# Altium schematic sheet Konwerter_USB_RS232_4porty.SchDoc: Konwerter 4x RS232 - USB
size B; Author: Szymon Feliński, Mateusz Goździk; DrawnBy: Szymon Feliński, Mateusz Goździk; SheetNumber: 1; SheetTotal: 1; SPICEModelCacheZGQTQYPO: <root> / <DocumentId>ZGQTQYPO</DocumentId> / <CacheFrame Number="0"> / <Model Name="cap" Kind="MDL"> / <Text>*Default semiconductor capacitor / .MODEL CAP C()</Text> / </Model> / </CacheFrame> / </root>
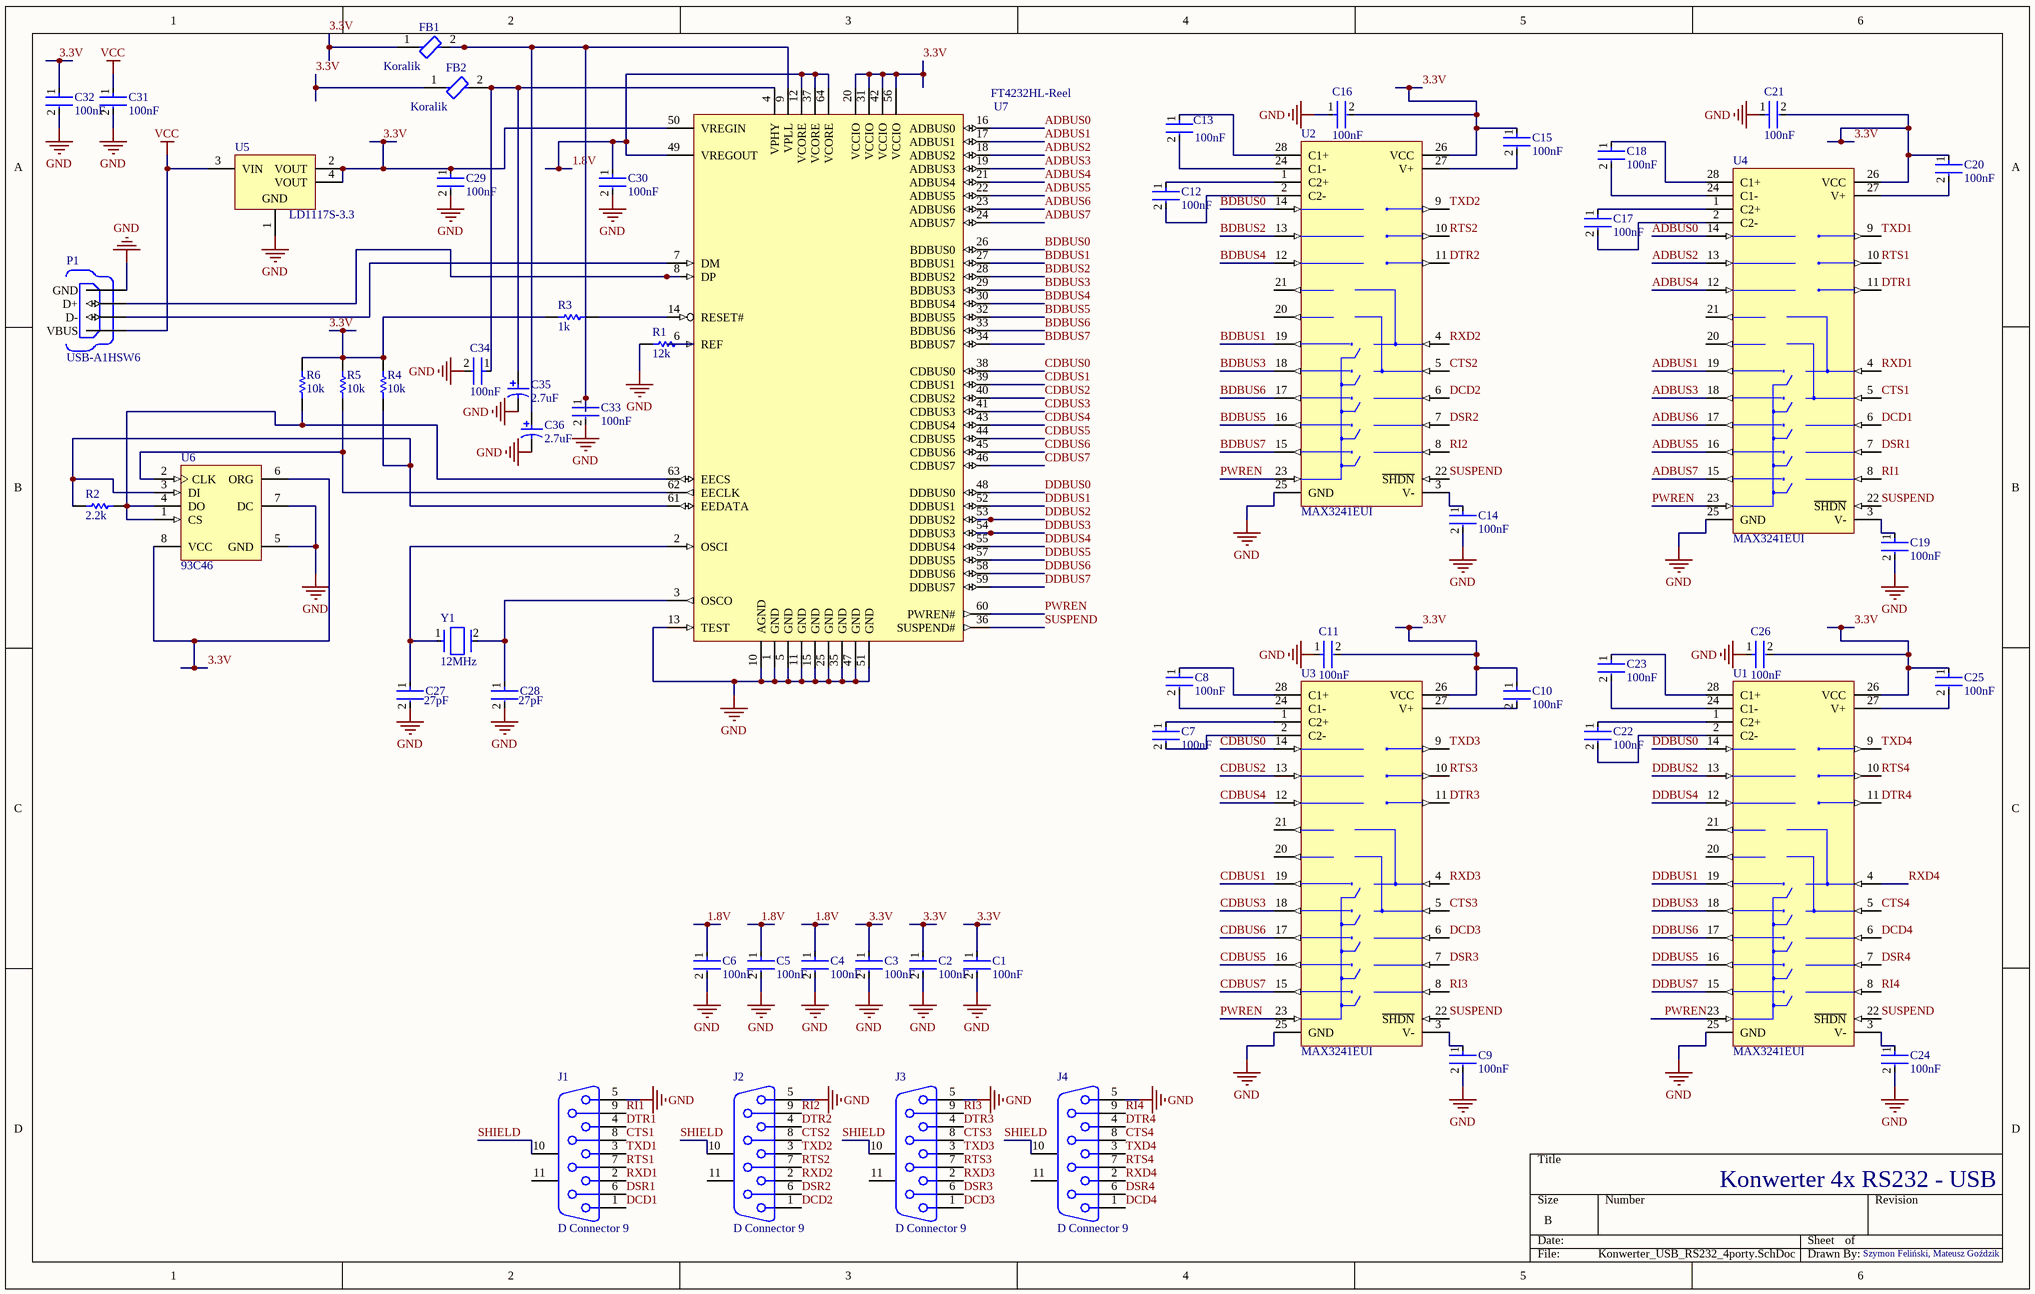
[diagram p0: Konwerter_USB_RS232_4porty.SchDoc]

## Parts
C1  100nF  [FP-C0603C-CF-MFG]
C2  100nF  [FP-C0603C-CF-MFG]
C3  100nF  [FP-C0603C-CF-MFG]
C4  100nF  [FP-C0603C-CF-MFG]
C5  100nF  [FP-C0603C-CF-MFG]
C6  100nF  [FP-C0603C-CF-MFG]
C7  100nF  [FP-C0603C-CF-MFG]
C8  100nF  [FP-C0603C-CF-MFG]
C9  100nF  [FP-C0603C-CF-MFG]
C10  100nF  [FP-C0603C-CF-MFG]
C11  100nF  [FP-C0603C-CF-MFG]
C12  100nF  [FP-C0603C-CF-MFG]
C13  100nF  [FP-C0603C-CF-MFG]
C14  100nF  [FP-C0603C-CF-MFG]
C15  100nF  [FP-C0603C-CF-MFG]
C16  100nF  [FP-C0603C-CF-MFG]
C17  100nF  [FP-C0603C-CF-MFG]
C18  100nF  [FP-C0603C-CF-MFG]
C19  100nF  [FP-C0603C-CF-MFG]
C20  100nF  [FP-C0603C-CF-MFG]
C21  100nF  [FP-C0603C-CF-MFG]
C22  100nF  [FP-C0603C-CF-MFG]
C23  100nF  [FP-C0603C-CF-MFG]
C24  100nF  [FP-C0603C-CF-MFG]
C25  100nF  [FP-C0603C-CF-MFG]
C26  100nF  [FP-C0603C-CF-MFG]
C27  27pF  [FP-C0603C-CF-MFG]
C28  27pF  [FP-C0603C-CF-MFG]
C29  100nF  [FP-C0603C-CF-MFG]
C30  100nF  [FP-C0603C-CF-MFG]
C31  100nF  [FP-C0603C-CF-MFG]
C32  100nF  [FP-C0603C-CF-MFG]
C33  100nF  [FP-C0603C-CF-MFG]
C34  100nF  [FP-C0603C-CF-MFG]
C35  2.7uF  [NIC-UCL1V101MNL1GS_L]
C36  2.7uF  [NIC-UCL1V101MNL1GS_L]
FB1  Koralik  [FP-BLM15-0_05-IPC_A]
FB2  Koralik  [FP-BLM15-0_05-IPC_A]
J1  D Connector 9  [DSUB1.385-2H9]
J2  D Connector 9  [DSUB1.385-2H9]
J3  D Connector 9  [DSUB1.385-2H9]
J4  D Connector 9  [DSUB1.385-2H9]
P1  USB-A1HSW6  [OST_USB-A1HSW6]
R1  12k  [RESC2013X50X30LL20T20]
R2  2.2k  [RESC2013X50X30LL20T20]
R3  1k  [RESC2013X50X30LL20T20]
R4  10k  [RESC2013X50X30LL20T20]
R5  10k  [RESC2013X50X30LL20T20]
R6  10k  [RESC2013X50X30LL20T20]
U1  MAX3241EUI  [TSSOP28_N]
U2  MAX3241EUI  [TSSOP28_N]
U3  MAX3241EUI  [TSSOP28_N]
U4  MAX3241EUI  [TSSOP28_N]
U5  LD1117S-3.3  [SOT-223_L]
U6  93C46  [ATML-8S1_B_L]
U7  FT4232HL-Reel  [LQFP-64_N]
Y1  12MHz  [FP-7A-MFG]

## Nets
GND: C1.2 C2.2 C3.2 C4.2 C5.2 C6.2 C9.2 C11.1 C14.2 C16.1 C19.2 C21.1 C24.2 C26.1 C27.2 C28.2 C29.2 C30.2 C31.2 C32.2 C33.2 C34.2 C35.2 C36.2 J1.5 J2.5 J3.5 J4.5 P1.4(GND) R1.1 U1.25(GND) U2.25(GND) U3.25(GND) U4.25(GND) U5.1(GND) U6.5(GND) U6.7(DC) U7.1(GND) U7.5(GND) U7.10(AGND) U7.11(GND) U7.13(TEST) U7.15(GND) U7.25(GND) U7.35(GND) U7.47(GND) U7.51(GND)
VCC: C31.1 P1.1(VBUS) U5.3(VIN)
1.8V: C4.1 C5.1 C6.1 C30.1 U7.12(VCORE) U7.37(VCORE) U7.49(VREGOUT) U7.64(VCORE)
3.3V: C1.1 C2.1 C3.1 C10.1 C11.2 C15.1 C16.2 C20.1 C21.2 C25.1 C26.2 C29.1 C32.1 FB1.1 FB2.1 R3.1 R4.2 R5.2 R6.2 U1.26(VCC) U2.26(VCC) U3.26(VCC) U4.26(VCC) U5.2(VOUT) U5.4(VOUT) U6.6(ORG) U6.8(VCC) U7.20(VCCIO) U7.31(VCCIO) U7.42(VCCIO) U7.50(VREGIN) U7.56(VCCIO)
ADBUS0: U4.14(T1IN) U7.16(ADBUS0)
ADBUS1: U4.19(R1OUT) U7.17(ADBUS1)
ADBUS2: U4.13(T2IN) U7.18(ADBUS2)
ADBUS3: U4.18(R2OUT) U7.19(ADBUS3)
ADBUS4: U4.12(T3IN) U7.21(ADBUS4)
ADBUS5: U4.16(R4OUT) U7.22(ADBUS5)
ADBUS6: U4.17(R3OUT) U7.23(ADBUS6)
ADBUS7: U4.15(R5OUT) U7.24(ADBUS7)
BDBUS0: U2.14(T1IN) U7.26(BDBUS0)
BDBUS1: U2.19(R1OUT) U7.27(BDBUS1)
BDBUS2: U2.13(T2IN) U7.28(BDBUS2)
BDBUS3: U2.18(R2OUT) U7.29(BDBUS3)
BDBUS4: U2.12(T3IN) U7.30(BDBUS4)
BDBUS5: U2.16(R4OUT) U7.32(BDBUS5)
BDBUS6: U2.17(R3OUT) U7.33(BDBUS6)
BDBUS7: U2.15(R5OUT) U7.34(BDBUS7)
CDBUS0: U3.14(T1IN) U7.38(CDBUS0)
CDBUS1: U3.19(R1OUT) U7.39(CDBUS1)
CDBUS2: U3.13(T2IN) U7.40(CDBUS2)
CDBUS3: U3.18(R2OUT) U7.41(CDBUS3)
CDBUS4: U3.12(T3IN) U7.43(CDBUS4)
CDBUS5: U3.16(R4OUT) U7.44(CDBUS5)
CDBUS6: U3.17(R3OUT) U7.45(CDBUS6)
CDBUS7: U3.15(R5OUT) U7.46(CDBUS7)
CTS1: J1.8 U4.5(R2IN)
CTS2: J2.8 U2.5(R2IN)
CTS3: J3.8 U3.5(R2IN)
CTS4: J4.8 U1.5(R2IN)
DCD1: J1.1 U4.6(R3IN)
DCD2: J2.1 U2.6(R3IN)
DCD3: J3.1 U3.6(R3IN)
DCD4: J4.1 U1.6(R3IN)
DDBUS0: U1.14(T1IN) U7.48(DDBUS0)
DDBUS1: U1.19(R1OUT) U7.52(DDBUS1)
DDBUS2: U1.13(T2IN) U7.53(DDBUS2)
DDBUS3: U1.18(R2OUT) U7.54(DDBUS3)
DDBUS4: U1.12(T3IN) U7.55(DDBUS4)
DDBUS5: U1.16(R4OUT) U7.57(DDBUS5)
DDBUS6: U1.17(R3OUT) U7.58(DDBUS6)
DDBUS7: U1.15(R5OUT) U7.59(DDBUS7)
DSR1: J1.6 U4.7(R4IN)
DSR2: J2.6 U2.7(R4IN)
DSR3: J3.6 U3.7(R4IN)
DSR4: J4.6 U1.7(R4IN)
DTR1: J1.4 U4.11(T3OUT)
DTR2: J2.4 U2.11(T3OUT)
DTR3: J3.4 U3.11(T3OUT)
DTR4: J4.4 U1.11(T3OUT)
PWREN: U1.23(~{EN}) U2.23(~{EN}) U3.23(~{EN}) U4.23(~{EN}) U7.60(PWREN#)
RI1: J1.9 U4.8(R5IN)
RI2: J2.9 U2.8(R5IN)
RI3: J3.9 U3.8(R5IN)
RI4: J4.9 U1.8(R5IN)
RTS1: J1.7 U4.10(T2OUT)
RTS2: J2.7 U2.10(T2OUT)
RTS3: J3.7 U3.10(T2OUT)
RTS4: J4.7 U1.10(T2OUT)
RXD1: J1.2 U4.4(R1IN)
RXD2: J2.2 U2.4(R1IN)
RXD3: J3.2 U3.4(R1IN)
RXD4: J4.2 U1.4(R1IN)
SHIELD: J1.10(MH1) J2.10(MH1) J3.10(MH1) J4.10(MH1)
SUSPEND: U1.22(~{SHDN}) U2.22(~{SHDN}) U3.22(~{SHDN}) U4.22(~{SHDN}) U7.36(SUSPEND#)
TXD1: J1.3 U4.9(T1OUT)
TXD2: J2.3 U2.9(T1OUT)
TXD3: J3.3 U3.9(T1OUT)
TXD4: J4.3 U1.9(T1OUT)
NetC7_1: C7.1 U3.1(C2+)
NetC7_2: C7.2 U3.2(C2-)
NetC8_1: C8.1 U3.28(C1+)
NetC8_2: C8.2 U3.24(C1-)
NetC9_1: C9.1 U3.3(V-)
NetC10_2: C10.2 U3.27(V+)
NetC12_1: C12.1 U2.1(C2+)
NetC12_2: C12.2 U2.2(C2-)
NetC13_1: C13.1 U2.28(C1+)
NetC13_2: C13.2 U2.24(C1-)
NetC14_1: C14.1 U2.3(V-)
NetC15_2: C15.2 U2.27(V+)
NetC17_1: C17.1 U4.1(C2+)
NetC17_2: C17.2 U4.2(C2-)
NetC18_1: C18.1 U4.28(C1+)
NetC18_2: C18.2 U4.24(C1-)
NetC19_1: C19.1 U4.3(V-)
NetC20_2: C20.2 U4.27(V+)
NetC22_1: C22.1 U1.1(C2+)
NetC22_2: C22.2 U1.2(C2-)
NetC23_1: C23.1 U1.28(C1+)
NetC23_2: C23.2 U1.24(C1-)
NetC24_1: C24.1 U1.3(V-)
NetC25_2: C25.2 U1.27(V+)
NetC27_1: C27.1 U7.2(OSCI) Y1.1
NetC28_1: C28.1 U7.3(OSCO) Y1.2
NetC33_1: C33.1 C36.1 FB1.2 U7.9(VPLL)
NetC34_1: C34.1 C35.1 FB2.2 U7.4(VPHY)
NetP1_2: P1.2(D-) U7.7(DM)
NetP1_3: P1.3(D+) U7.8(DP)
NetR1_2: R1.2 U7.6(REF)
NetR2_1: R2.1 R4.1 U6.3(DI) U7.61(EEDATA)
NetR2_2: R2.2 R6.1 U6.1(CS) U6.4(DO) U7.63(EECS)
NetR3_2: R3.2 U7.14(RESET#)
NetR5_1: R5.1 U6.2(CLK) U7.62(EECLK)

Not connected (* = marked no-connect by the designer): J1 11(MH2); J2 11(MH2); J3 11(MH2); J4 11(MH2); U1 20(R2OUTB) 21(R1OUTB); U2 20(R2OUTB) 21(R1OUTB); U3 20(R2OUTB) 21(R1OUTB); U4 20(R2OUTB) 21(R1OUTB)

## Library data of the parts
C1-C34 = CMP-2006-03061-2: CAP CER 0.1UF 50V X7R 0603; Manufacturer: KEMET; Manufacturer Part Number: C0603C104K5RACTU; Tolerance: 0.1; Temperature Coefficient: 30ppm/°C; Material: Ceramic; Automotive Grade: Grade 1; Value: 0.10 μF; Temperature: -55°C to +125°C; RoHS: TRUE; Temperature Range High: +125°C; Lead Free: Yes; Octopart: https://octopart.com/c0603c104k5ractu-kemet-139244; Digikey Description: CAP CER 0.1UF 50V X7R 0603; Category: Cap; Package: C0603C-CF; ComponentLink2Description: Datasheet; Temperature Range Low: -55°C; Device Class L1: Passive Components; Voltage Rating: 50 V; Automotive: Yes; Device Class L3: Ceramic Capacitors; ComponentLink2URL: https://api.kemet.com/component-edge/download/datasheet/C0603C100J5GACAUTO.pdf; Capacitance: 0.10 μF; Device Class L2: Capacitors; Temperature Characteristic: X7R; Height: 0.87mm
C35 C36 = CMP-2000-07344-1: Aluminum Electrolytic Capacitor, 100 uF, 35 V, 20%, -55 to 105 degC, 2-Pin SMD, RoHS, Tape and Reel; Manufacturer: Nichicon; Capacitance: 100uF; Dissipation Factor DF: 0.12; Case Diameter: 8mm; Ripple Current: 850mA; Type: AluminumElectrolyticCapacitors,ChipType,LowImpedance; Case Height: 8.3mm; Leakage Current: 3uA; Voltage Rating DC: 35V; Load Life: 2000h; Case Length: 10mm; Series: CL; Minimum Operating Temperature: -55C; Datasheet URL: http://datasheet.octopart.com/UCL1V101MNL1GS-Nichicon-datasheet-41194108.pdf; Manufacturer URL: http://www.nichicon.co.jp/english/; Maximum Operating Temperature: +105C; Package Reference: UCL1V101MNL1GS; Operating Temperature Range: -55Cto+105C; Brand: Nichicon; Package Description: 2-Pin Surface Mount Device, Body 8.3 x 8.3 mm, Height 10.8 mm; RoHS: Details; Voltage Rating: 35V; Dimensions: 8mmDia.x10mmLx8.3mmH; Termination Style: SMD/SMT; Datasheet Version: 01/2015; Packaging: Reel; Mounting Technology: SurfaceMount; Product Category: AluminumElectrolyticCapacitors-SMD; Factory Pack Quantity: 500; Product: LowImpedanceElectrolyticCapacitors; Tolerance: 20%
FB1 FB2 = CMP-0686-00232-4: Chip Ferrite Bead, 0402, 220Ω @ 100MHz, 0.18Ω, 25%, 600mA; DC Resistance (DCR): 180mR; Number of Lines: 1; Impedance: 220R; Packaging: Tape and Reel; Case Code (Imperial): 0402; Current Rating: 600mA; Max Current Rating: 600mA; Min Operating Temperature: -55°C; Length: 1mm; Lead Free: Lead Free; Material: Ferrite; Number of Circuits: 1; Package Quantity: 1; Max Operating Temperature: 125°C; Termination: SMD/SMT; Width: 0.5mm; REACH SVHC: No SVHC; Case/Package: 0402; Test Frequency: 100MHz; Tolerance: 25%; Number of Pins: 2; Height: 0.5mm; Case Code (Metric): 1005; Max DC Current: 600mA; Depth: 0.5mm
J1-J4 = D Connector 9: Receptacle Assembly, 9 Position, Right Angle; PackageDocument: O; Positions: 9; Published: 15-Jun-2001; LatestRevisionDate: 17-Jul-2002; LatestRevisionNote: Re-released for DXP Platform.; DatasheetDocument: 1-Sep-1999; PackageReference: 788750; Publisher: Altium Limited; Orientation: Right Angle; Gender: Receptacle
P1 = USB-A1HSW6: USB-A _USB TYPE-A_  Receptacle Connector 4 Position Through Hole, Right Angle; MF: On Shore; SnapEDA_Link: https://www.snapeda.com/parts/USB-A1HSW6/On%20Shore%20Technology%20Inc./view-part/13110/?ref=snap; Package: None; MP: USB-A1HSW6; Availability: Unavailable; Price: None; Value: *
R1-R6 = CMP-2001-04896-1: Manufacturer: Vishay Dale; Part Number: CRCW08050000Z0EA
U1-U4 = MAX3241EUI: 3.0V TO 5.5V, Low-Power, up to 1Mbps, True RS-232 Transceiver Using Four 0.1µF External Capacitor; Published: 16-Jan-2001; LatestRevisionDate: 29-May-2009; LatestRevisionNote: IPC-7351 Footprint Added.; DatasheetVersion: Mar-1999; PackageVersion: 21-0066 C; PackageReference: TSSOP28; Publisher: Altium Limited; PackageDescription: 28-Pin Thin Small Outline Package 0.65 mm Pitch; ComponentLink1Description: Manufacturer Link; ComponentLink1URL: http://www.maxim-ic.com/; ComponentLink2Description: Datasheet; ComponentLink2URL: http://pdfserv.maxim-ic.com/en/ds/MAX3222-MAX3241.pdf
U5 = CMP-0244-00310-1: Fixed Low Drop Positive Voltage Regulator, 3.3V, 4-Pin SOT-223, Tape and Reel; ComponentLink2Description: Datasheet; PackageDescription: 4-Pin SOT-223 Package, 6.5 x 3.5 mm Body, 2.3 mm Pitch, 7 mm Lead Span; PackageVersion: 2010; ComponentLink2URL: http://www.st.com/internet/com/TECHNICAL_RESOURCES/TECHNICAL_LITERATURE/DATASHEET/CD00000544.pdf; PackageReference: SOT-223; DatasheetVersion: 1/11/2011; ComponentLink1Description: Manufacturer URL; ComponentLink1URL: http://www.st.com
U6 = CMP-2000-05871-1: Three-Wire Serial EEPROM, 2.7 to 5.5 V, -40 to 85 degC, 8-Pin SOIC, RoHS, Tube; Manufacturer: Atmel; Access Time (Max): 250ns; Operating Supply Voltage (Typ): 3.3/5V; Supply Current: 2mA; Interface Type: Serial(3-Wire); Organization: 128x8/64x16; Data Retention: 100Year; Operating Supply Voltage (Min): 2.7V; Density: 1Kb; Operating Supply Voltage (Max): 5.5V; Frequency: 1MHz; Write Protection: Yes; Package Type: SOICN; Manufacturer URL: http://www.atmel.com/; Package Description: 8-Pin Small Outline Integrated Circuit, Body 4.9 x 3.9 mm, Pitch 1.27 mm; Operating Temperature Classification: Industrial; Operating Temp Range: -40Cto85C; Mounting Technology: SurfaceMount; Mounting: SurfaceMount; Datasheet Version: 09/2005; Package Reference: 8S1; Datasheet URL: http://www.atmel.com/images/doc0172z.pdf; Pin Count: 8
U7 = FT4232HL-Reel: Quad High Speed USB To Multipurpose UART/MPSSE IC, LQFP-64, Tape and Reel; Published: 19-Aug-2010; DatasheetVersion: ver 2.08, May-2010; PackageVersion: 2010; PackageReference: LQFP-64; Publisher: Altium Limited; PackageDescription: 64-Pin Thin Quad Flat Pack, 10 x 10 x 1.4 mm Body, 0.5 mm Pitch; ComponentLink1Description: Manufacturer Link; ComponentLink1URL: http://www.ftdichip.com/Products/ICs/FT4232H.htm; ComponentLink2Description: Datasheet; ComponentLink2URL: http://www.ftdichip.com/Support/Documents/DataSheets/ICs/DS_FT4232H.pdf
Y1 = CMP-18717-000115-1: Quartz Crystal 48MHz, 30ppm, 12pF, 50Ω; ESR (Equivalent Series Resistance): 100R; Tolerance: 30ppm; Number of Pins: 2; Length: 0.197inch; Case/Package: SMD/SMT; Frequency Stability: 30ppm; Package Quantity: 1000; Termination: SMD/SMT; Width: 0.126inch; Frequency Tolerance: 30ppm; Packaging: Tape and Reel; Series: 7A; Height: 0.053inch; Lead Free: Contains Lead; Load Capacitance: 12pF; Mount: Surface Mount; Min Operating Temperature: -40°C; Frequency: 48MHz; Max Operating Temperature: 85°C